# Altium project PCB_module.PrjPcb
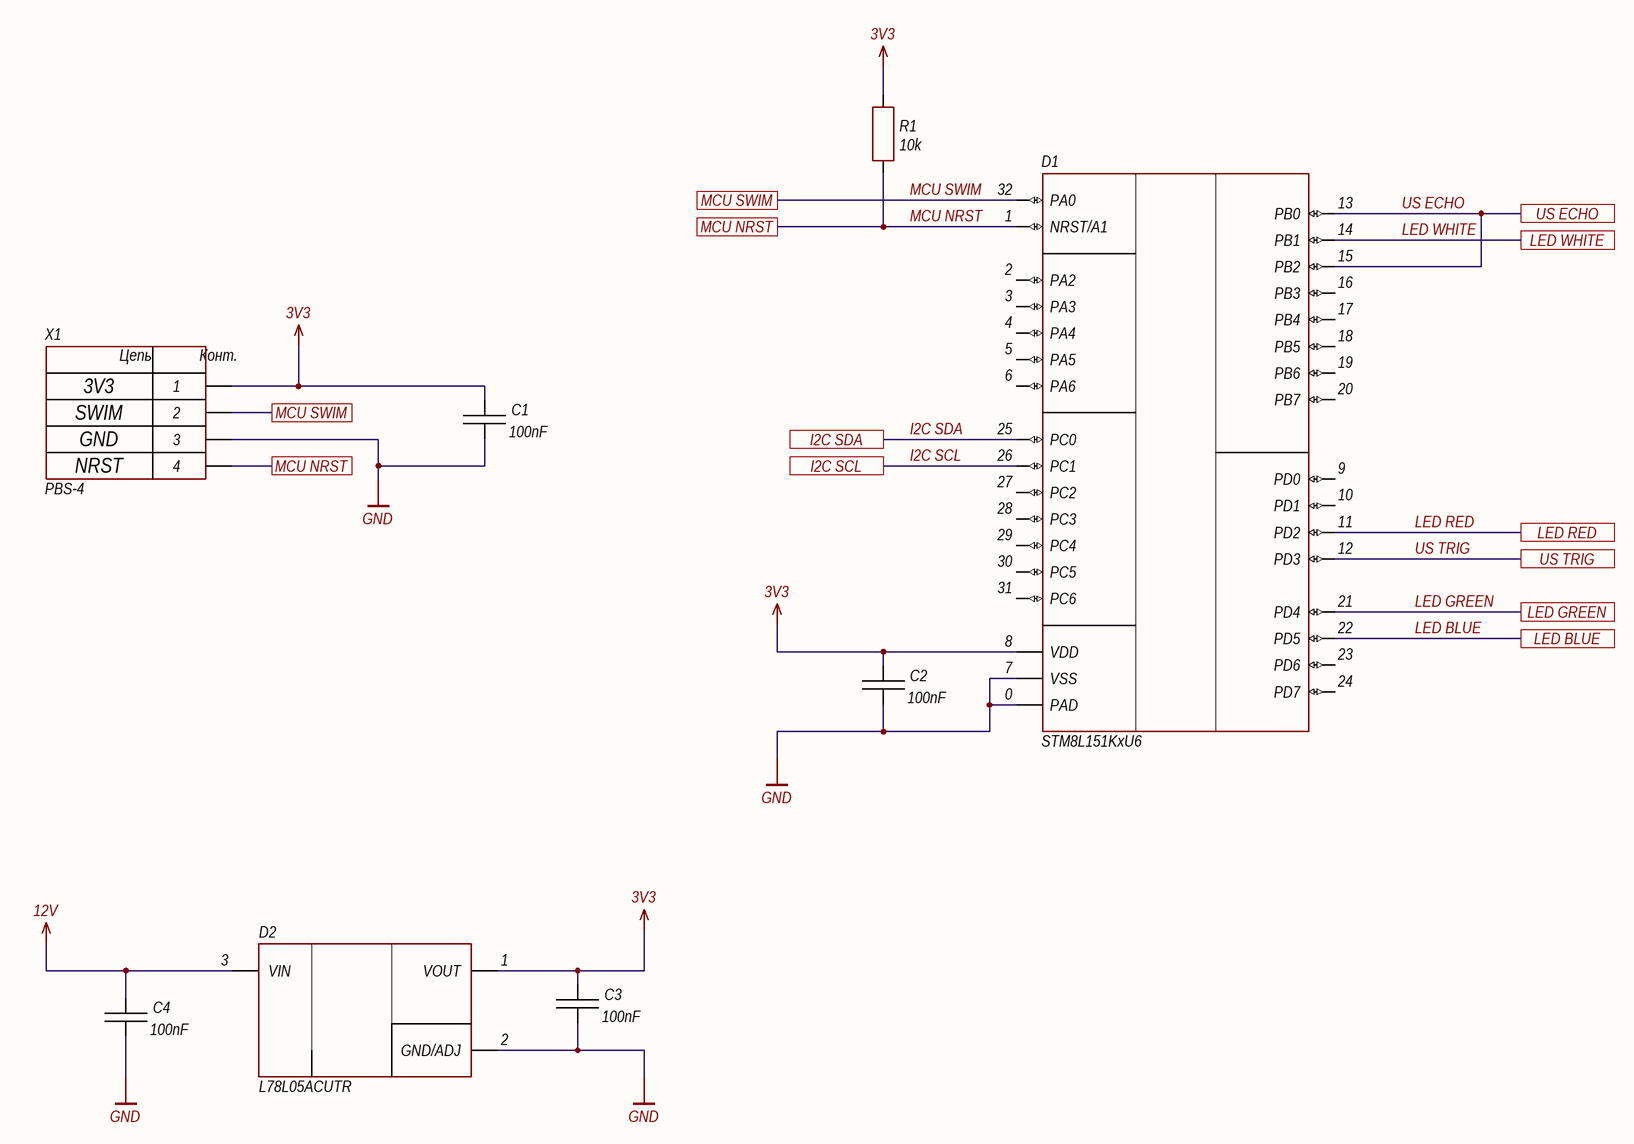
[diagram p0: MCU.SchDoc]
ProjectAuthor: Clark A.; ProjectCompanyName: Azek Clark © 2020; ProjectNumber: STL; ProjectRevision: 001; ProjectTitle: Smart Stairs LED
4 sheets, 33 parts. Net scope: flat (ports and power ports of the same name join across sheets).
Board file: PCB.001.PcbDoc
Sheets:
  MCU.SchDoc
  Transistor.SchDoc
  I2C Conventor.SchDoc
  ultrasonic.SchDoc

## Sheet MCU.SchDoc: =ProjectTitle
size 420 x 297 mm; Author: Clark A.; CompanyName: Azek Clark © 2020; Address1: Address1; Address2: Address2; Address3: Address3; Address4: Address4; DocumentNumber: STL 001; SheetNumber: 1; SheetTotal: 4; Scale: 1:1; DocumentType: Схема электрическая принципиальная; FirstReferrence: STL

### Parts
C1  100nF  [CH0603C]
C2  100nF  [CH0603C]
C3  100nF  [CH0603C]
C4  100nF  [CH0603C]
D1  STM8L151KxU6  [32-UFQFPN]
D2  L78L05ACUTR  [SOT89_123]
R1  10k  [CH0603R]
X1  PBS-4  [CON: PBS-4]

### Ports
I2C SCL, I2C SDA, LED BLUE, LED GREEN, LED RED, LED WHITE, MCU NRST, MCU SWIM, US ECHO, US TRIG

### Nets
3V3: C1.2 C2.2 C3.2 D1.8(VDD) D2.1(VOUT) R1.2 X1.1
12V: C4.2 D2.3(VIN)
GND: C1.1 C2.1 C3.1 C4.1 D1.0(PAD) D1.7(VSS) D2.2(GND/ADJ) X1.3
I2C SCL: D1.26(PC1) ; port I2C SCL
I2C SDA: D1.25(PC0) ; port I2C SDA
LED BLUE: D1.22(PD5) ; port LED BLUE
LED GREEN: D1.21(PD4) ; port LED GREEN
LED RED: D1.11(PD2) ; port LED RED
LED WHITE: D1.14(PB1) ; port LED WHITE
MCU NRST: D1.1(NRST/A1) R1.1 X1.4 ; port MCU NRST
MCU SWIM: D1.32(PA0) X1.2 ; port MCU SWIM
US ECHO: D1.13(PB0) D1.15(PB2) ; port US ECHO
US TRIG: D1.12(PD3) ; port US TRIG

Not connected (* = marked no-connect by the designer): D1 2(PA2) 3(PA3) 4(PA4) 5(PA5) 6(PA6) 9(PD0) 10(PD1) 16(PB3) 17(PB4) 18(PB5) 19(PB6) 20(PB7) 23(PD6) 24(PD7) 27(PC2) 28(PC3) 29(PC4) 30(PC5) 31(PC6)

### Notes on the sheet
- 3V3
- SWIM
- GND
- NRST
- Перв. примен.
- Справ. №
- Подп. и дата
- Инв. № дубл.
- Взам. инв. №
- Разраб.
- Изм.
- Лист
- № докум.
- Подп.
- Дата
- Лит.
- Масса
- Масштаб
- Пров.
- Т.контр.
- Листов
- Инв. № подл.
- Утв.
- Н.контр.
- 2.106-A3
- Копировал
- Формат А3

### Library data of the parts
C1-C4 = Capacitor: Manufacturer: *; Model: *; HelpURL: *; ComponentKind: *; Value: 100nF
D1 = STM8L151KxU6: STM8; Manufacturer: ST Microelectronics; Model: STM8L151GxU6; ComponentKind: UFQFPN28; HelpURL: https://ru.mouser.com/datasheet/2/389/stm8l151c4-956418.pdf
D2 = L78LxxACUTR: Step-down; Manufacturer: ST Microelectronics; Model: L78L05ACUTR; HelpURL: https://www.st.com/resource/en/datasheet/l78l.pdf; ComponentKind: SOT-89, 100mA
R1 = Resistor: Manufacturer: *; Model: *; HelpURL: *; ComponentKind: *; Value: 10k
X1 = 4-Connector: Model: PBS-4; Manufacturer: *; HelpURL: *; ComponentKind: *

## Sheet Transistor.SchDoc: =ProjectTitle
size 420 x 297 mm; Author: Clark A.; CompanyName: Azek Clark © 2020; Address1: Address1; Address2: Address2; Address3: Address3; Address4: Address4; DocumentNumber: STL 001; SheetNumber: 2; SheetTotal: 4; Scale: 1:1; DocumentType: Схема электрическая принципиальная; FirstReferrence: STL
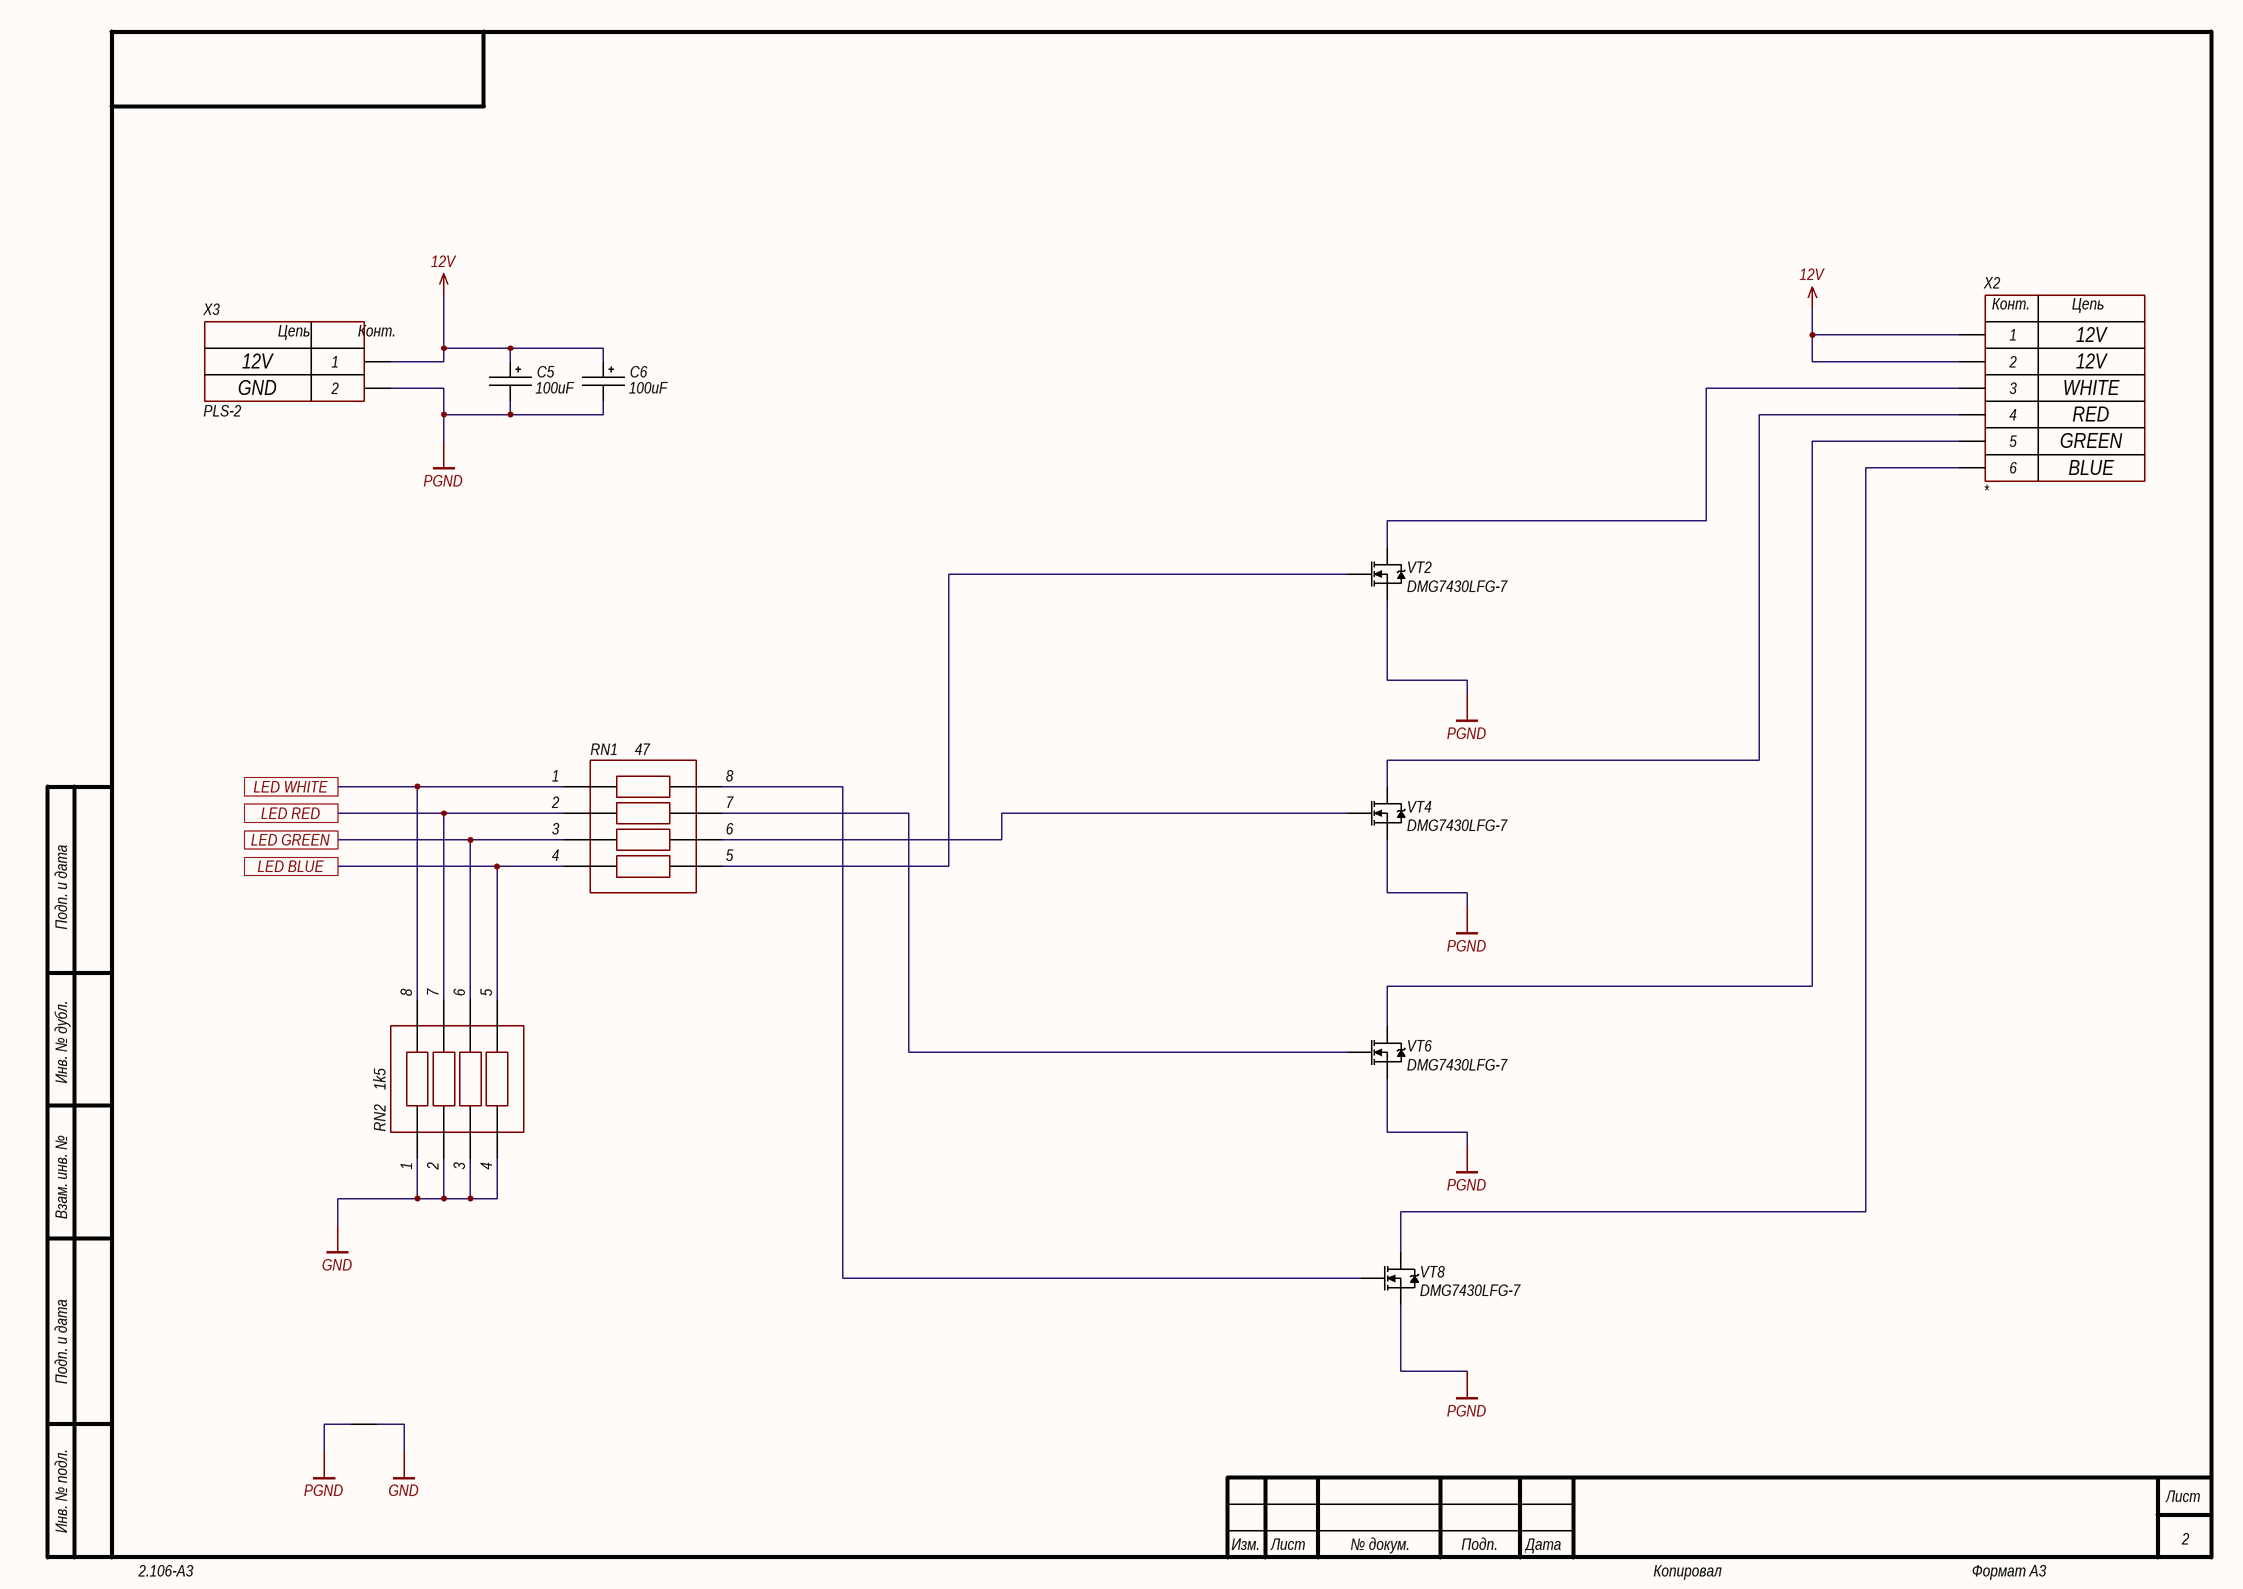
[diagram p1: Transistor.SchDoc]

### Parts
C5  100uF  [D5C2H11]
C6  100uF  [D5C2H11]
RN1  47  [CH0603Rx4 (1206)]
RN2  1k5  [CH0603Rx4 (1206)]
VT2  DMG7430LFG-7  [TRANS: PowerDI®3333-8]
VT4  DMG7430LFG-7  [TRANS: PowerDI®3333-8]
VT6  DMG7430LFG-7  [TRANS: PowerDI®3333-8]
VT8  DMG7430LFG-7  [TRANS: PowerDI®3333-8]
W1  Net Tie  [CON: Net Tie]  (value not drawn)  (net tie, no BOM)
X2  *  [CON: PLS-6]
X3  PLS-2  [CON: PLS-2]

### Ports
LED BLUE, LED GREEN, LED RED, LED WHITE

### Nets
12V: C5.1 C6.1 X2.1 X2.2 X3.1
GND: RN2.1 RN2.2 RN2.3 RN2.4 W1.2
PGND: C5.2 C6.2 VT2.3(S) VT4.3(S) VT6.3(S) VT8.3(S) W1.1 X3.2
LED BLUE: RN1.4 RN2.5 ; port LED BLUE
LED GREEN: RN1.3 RN2.6 ; port LED GREEN
LED RED: RN1.2 RN2.7 ; port LED RED
LED WHITE: RN1.1 RN2.8 ; port LED WHITE
NetRN1_5: RN1.5 VT2.1(G)
NetRN1_6: RN1.6 VT4.1(G)
NetRN1_7: RN1.7 VT6.1(G)
NetRN1_8: RN1.8 VT8.1(G)
NetVT2_2: VT2.2(D) X2.3
NetVT4_2: VT4.2(D) X2.4
NetVT6_2: VT6.2(D) X2.5
NetVT8_2: VT8.2(D) X2.6

### Notes on the sheet
- 12V
- GND
- WHITE
- RED
- GREEN
- BLUE
- Подп. и дата
- Инв. № дубл.
- Взам. инв. №
- Инв. № подл.
- Изм.
- Лист
- № докум.
- Подп.
- Дата
- 2.106-A3
- Копировал
- Формат А3
- (in symbol 2-Connector) Цепь; Конт.
- (in symbol 6-Connector) Конт.; Цепь

### Library data of the parts
C5 C6 = AlumCap: Manufacturer: *; Model: *; HelpURL: *; ComponentKind: *; Value: 100uF
RN1 RN2 = Resistor assembly: Manufacturer: Bourns GmbH.; Model: CAT16-J4; HelpURL: https://www.terraelectronica.ru/pdf/show?pdf_file=https%253A%252F%252Fwww.mouser.com%252Fds%252F2%252F54%252FATCAY-777361.pdf; ComponentKind: *
  RN1: Value: 47
  RN2: Value: 1k5
VT2 VT4 VT6 VT8 = N-chanel: Mosfet; Manufacturer: Diodes Incorporated; Model: DMG7430LFG-7; ComponentKind: 30V, 10A; HelpURL: https://www.diodes.com/assets/Datasheets/DMG7430LFG.pdf
X2 = 6-Connector: Model: *; Manufacturer: *; HelpURL: *; ComponentKind: *
X3 = 2-Connector: Model: PLS-2; Manufacturer: *; HelpURL: *; ComponentKind: *

## Sheet I2C Conventor.SchDoc: =ProjectTitle
size 297 x 209 mm; Author: Clark A.; CompanyName: Azek Clark © 2020; Address1: Address1; Address2: Address2; Address3: Address3; Address4: Address4; DocumentNumber: STL 001; SheetNumber: 3; SheetTotal: 4; Scale: 1:1; DocumentType: Схема электрическая принципиальная; FirstReferrence: STL
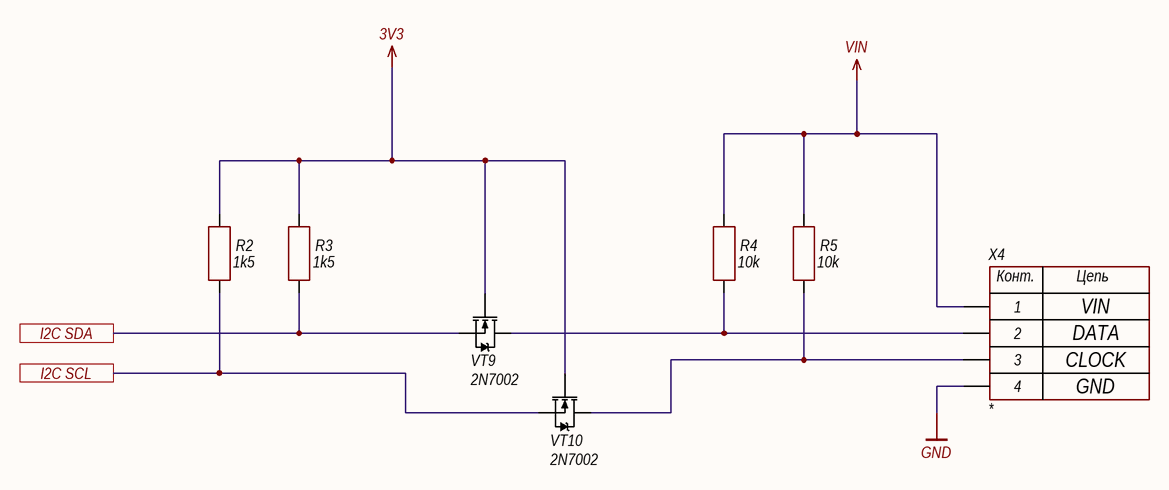
[diagram p2: I2C Conventor.SchDoc]

### Parts
R2  1k5  [CH0603R]
R3  1k5  [CH0603R]
R4  10k  [CH0603R]
R5  10k  [CH0603R]
VT9  2N7002  [SOT23_123]
VT10  2N7002  [SOT23_123]
X4  *  [CON: PLS-4]

### Ports
I2C SCL, I2C SDA

### Nets
3V3: R2.2 R3.2 VT9.1(G) VT10.1(G)
GND: X4.4
VIN: R4.2 R5.2 X4.1
I2C SCL: R2.1 VT10.3(S) ; port I2C SCL
I2C SDA: R3.1 VT9.3(S) ; port I2C SDA
NetR4_1: R4.1 VT9.2(D) X4.2
NetR5_1: R5.1 VT10.2(D) X4.3

### Notes on the sheet
- VIN
- DATA
- CLOCK
- GND
- Инв. № подл.
- Подп. и дата
- Взам. инв. №
- Инв. № дубл.
- Изм.
- Лист
- № докум.
- Подп.
- Дата
- Копировал
- Формат А4
- (in symbol 4-Connector) Конт.; Цепь

### Library data of the parts
R2-R5 = Resistor: Manufacturer: *; Model: *; HelpURL: *; ComponentKind: *
  R2 R3: Value: 1k5
  R4 R5: Value: 10k
VT9 VT10 = N-chanel: Mosfet; Manufacturer: ON Semiconductor; Model: 2N7002; ComponentKind: 0.2А, 60В; HelpURL: https://static.chipdip.ru/lib/318/DOC000318735.pdf
X4 = 4-Connector: Model: *; Manufacturer: *; HelpURL: *; ComponentKind: *

## Sheet ultrasonic.SchDoc: =ProjectTitle
size 297 x 209 mm; Author: Clark A.; CompanyName: Azek Clark © 2020; Address1: Address1; Address2: Address2; Address3: Address3; Address4: Address4; DocumentNumber: STL 001; SheetNumber: 4; SheetTotal: 4; Scale: 1:1; DocumentType: Схема электрическая принципиальная; FirstReferrence: STL
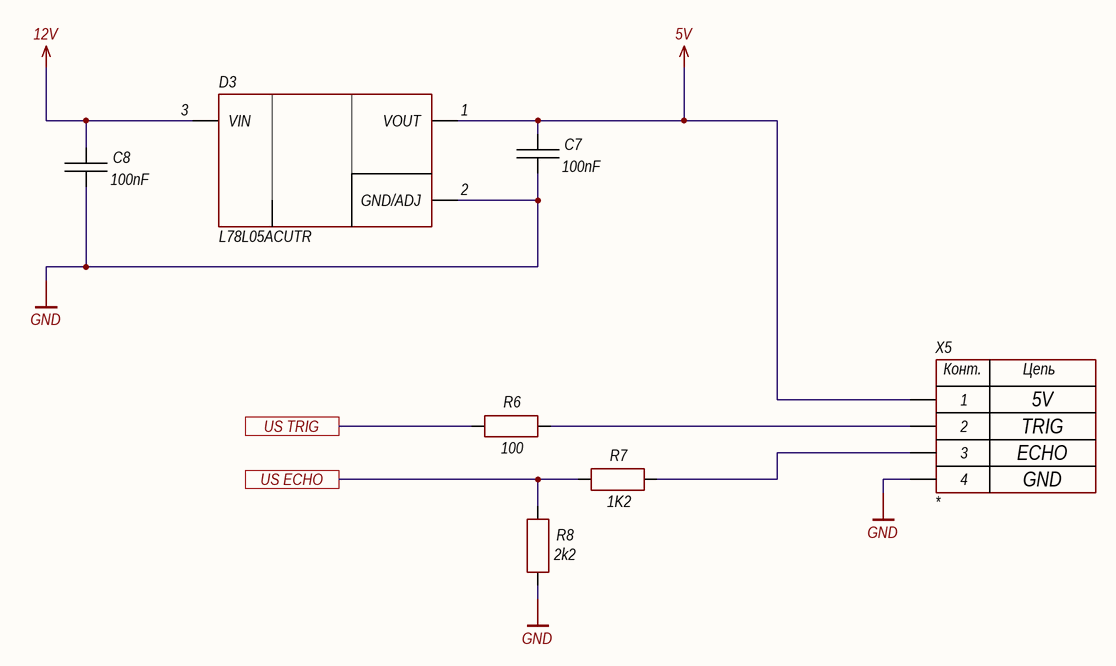
[diagram p3: ultrasonic.SchDoc]

### Parts
C7  100nF  [CH0603C]
C8  100nF  [CH0603C]
D3  L78L05ACUTR  [SOT89_123]
R6  100  [CH0603R]
R7  1K2  [CH0603R]
R8  2k2  [CH0603R]
X5  *  [CON: PBS-4]

### Ports
US ECHO, US TRIG

### Nets
5V: C7.2 D3.1(VOUT) X5.1
12V: C8.2 D3.3(VIN)
GND: C7.1 C8.1 D3.2(GND/ADJ) R8.1 X5.4
US ECHO: R7.1 R8.2 ; port US ECHO
US TRIG: R6.1 ; port US TRIG
NetR6_2: R6.2 X5.2
NetR7_2: R7.2 X5.3

### Notes on the sheet
- 5V
- TRIG
- ECHO
- GND
- Инв. № подл.
- Подп. и дата
- Взам. инв. №
- Инв. № дубл.
- Изм.
- Лист
- № докум.
- Подп.
- Дата
- Копировал
- Формат А4
- (in symbol 4-Connector) Конт.; Цепь

### Library data of the parts
C7 C8 = Capacitor: Manufacturer: *; Model: *; HelpURL: *; ComponentKind: *; Value: 100nF
D3 = L78LxxACUTR: as D2 on sheet MCU; Model: L78L05ACUTR; HelpURL: https://www.st.com/resource/en/datasheet/l78l.pdf; ComponentKind: SOT-89, 100mA
R6-R8 = Resistor: Manufacturer: *; Model: *; HelpURL: *; ComponentKind: *
  R6: Value: 100
  R7: Value: 1K2
  R8: Value: 2k2
X5 = 4-Connector: Model: *; Manufacturer: *; HelpURL: *; ComponentKind: *

## Nets that join several sheets
3V3: MCU (7 pins), I2C Conventor (R2.2 R3.2 VT9.1 VT10.1)
12V: MCU (C4.2 D2.3), Transistor (5 pins), ultrasonic (C8.2 D3.3)
GND: MCU (8 pins), Transistor (5 pins), I2C Conventor (X4.4), ultrasonic (5 pins)
I2C SCL: MCU (D1.26), I2C Conventor (R2.1 VT10.3)
I2C SDA: MCU (D1.25), I2C Conventor (R3.1 VT9.3)
LED BLUE: MCU (D1.22), Transistor (RN1.4 RN2.5)
LED GREEN: MCU (D1.21), Transistor (RN1.3 RN2.6)
LED RED: MCU (D1.11), Transistor (RN1.2 RN2.7)
LED WHITE: MCU (D1.14), Transistor (RN1.1 RN2.8)
US ECHO: MCU (D1.13 D1.15), ultrasonic (R7.1 R8.2)
US TRIG: MCU (D1.12), ultrasonic (R6.1)